# Altium schematic sheet Ref&Supply Unit.SchDoc
size A4; DocumentNumber: 5; SheetNumber: 5; SheetTotal: 7
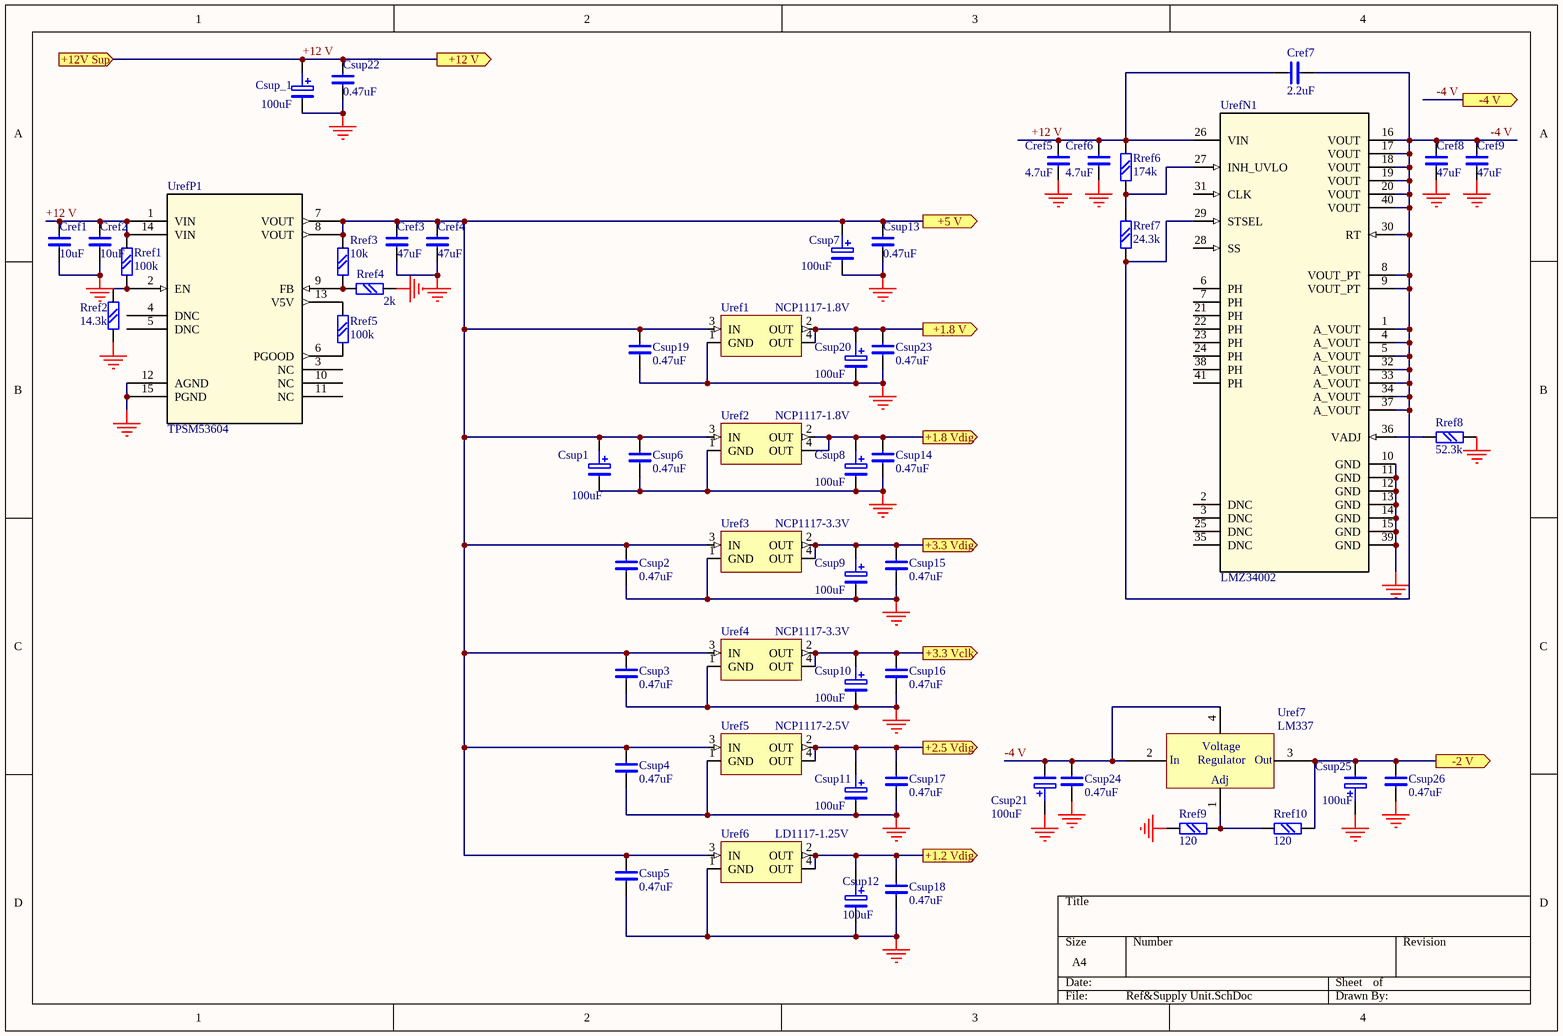
[diagram p0: Ref&Supply Unit.SchDoc]

## Parts
Cref1  10uF  [CHIP1206]
Cref2  10uF  [CHIP1206]
Cref3  47uF  [CHIP1206]
Cref4  47uF  [CHIP1206]
Cref5  4.7uF  [chip0805]
Cref6  4.7uF  [chip0805]
Cref7  2.2uF  [chip0805]
Cref8  47uF  [chip1206]
Cref9  47uF  [chip1206]
Csup1  100uF  [CEL-SMD300]
Csup2  0.47uF  [chip0603]
Csup3  0.47uF  [chip0603]
Csup4  0.47uF  [chip0603]
Csup5  0.47uF  [chip0603]
Csup6  0.47uF  [chip0603]
Csup7  100uF  [CEL-SMD300]
Csup8  100uF  [CEL-SMD300]
Csup9  100uF  [CEL-SMD300]
Csup10  100uF  [CEL-SMD300]
Csup11  100uF  [CEL-SMD300]
Csup12  100uF  [CEL-SMD300]
Csup13  0.47uF  [chip0603]
Csup14  0.47uF  [chip0603]
Csup15  0.47uF  [chip0603]
Csup16  0.47uF  [chip0603]
Csup17  0.47uF  [chip0603]
Csup18  0.47uF  [chip0603]
Csup19  0.47uF  [chip0603]
Csup20  100uF  [CEL-SMD300]
Csup21  100uF  [CEL-SMD300]
Csup22  0.47uF  [chip0603]
Csup23  0.47uF  [chip0603]
Csup24  0.47uF  [chip0603]
Csup25  100uF  [CEL-SMD300]
Csup26  0.47uF  [chip0603]
Csup_1  100uF  [CEL-SMD300]
Rref1  100k  [chip0603]
Rref2  14.3k  [chip0603]
Rref3  10k  [chip0603]
Rref4  2k  [chip0603]
Rref5  100k  [chip0603]
Rref6  174k  [chip0603]
Rref7  24.3k  [chip0603]
Rref8  52.3k  [chip0603]
Rref9  120  [chip0603]
Rref10  120  [chip0603]
Uref1  NCP1117-1.8V  [369A-13]
Uref2  NCP1117-1.8V  [369A-13]
Uref3  NCP1117-3.3V  [369A-13]
Uref4  NCP1117-3.3V  [369A-13]
Uref5  NCP1117-2.5V  [369A-13]
Uref6  LD1117-1.25V  [369A-13]
Uref7  LM337  [SOT-223]
UrefN1  LMZ34002  [B1QFN-41]
UrefP1  TPSM53604  [B3QFN-15]

## Ports
+1.2 Vdig (out), +1.8 V (out), +1.8 Vdig (out), +2.5 Vdig (out), +3.3 Vclk (out), +3.3 Vdig (out), +5 V (out), +12 V (out), +12V Sup (in), -2 V (out), -4 V (out)

## Nets
GND: Cref1.2 Cref2.2 Cref3.2 Cref4.2 Cref5.2 Cref6.2 Cref8.2 Cref9.2 Csup1.- Csup2.2 Csup3.2 Csup4.2 Csup5.2 Csup6.2 Csup7.- Csup8.- Csup9.- Csup10.- Csup11.- Csup12.- Csup13.2 Csup14.2 Csup15.2 Csup16.2 Csup17.2 Csup18.2 Csup19.2 Csup20.- Csup21.+ Csup22.2 Csup23.2 Csup24.2 Csup25.+ Csup26.2 Csup_1.- Rref2.1 Rref4.1 Rref8.2 Rref9.2 Uref1.1(GND) Uref2.1(GND) Uref3.1(GND) Uref4.1(GND) Uref5.1(GND) Uref6.1(GND) UrefN1.10(GND) UrefN1.11(GND) UrefN1.12(GND) UrefN1.13(GND) UrefN1.14(GND) UrefN1.15(GND) UrefN1.39(GND) UrefP1.12(AGND) UrefP1.15(PGND)
+1.2 Vdig: Csup12.+ Csup18.1 Uref6.2(OUT) Uref6.4(OUT) ; port +1.2 Vdig
+1.8 V: Csup20.+ Csup23.1 Uref1.2(OUT) Uref1.4(OUT) ; port +1.8 V
+1.8 Vdig: Csup8.+ Csup14.1 Uref2.2(OUT) Uref2.4(OUT) ; port +1.8 Vdig
+2.5 Vdig: Csup11.+ Csup17.1 Uref5.2(OUT) Uref5.4(OUT) ; port +2.5 Vdig
+3.3 Vclk: Csup10.+ Csup16.1 Uref4.2(OUT) Uref4.4(OUT) ; port +3.3 Vclk
+3.3 Vdig: Csup9.+ Csup15.1 Uref3.2(OUT) Uref3.4(OUT) ; port +3.3 Vdig
+5 V: Cref3.1 Cref4.1 Csup1.+ Csup2.1 Csup3.1 Csup4.1 Csup5.1 Csup6.1 Csup7.+ Csup13.1 Csup19.1 Rref3.2 Uref1.3(IN) Uref2.3(IN) Uref3.3(IN) Uref4.3(IN) Uref5.3(IN) Uref6.3(IN) UrefP1.7(VOUT) UrefP1.8(VOUT) ; port +5 V
+12 V: Cref1.1 Cref2.1 Cref5.1 Cref6.1 Cref7.1 Csup22.1 Csup_1.+ Rref1.2 Rref6.2 UrefN1.26(VIN) UrefP1.1(VIN) UrefP1.14(VIN) ; port +12V Sup, port +12 V
-2 V: Csup25.- Csup26.1 Rref10.1 Uref7.3(Out) ; port -2 V
-4 V: Cref7.2 Cref8.1 Cref9.1 Csup21.- Csup24.1 Rref7.1 Uref7.2(In) Uref7.4(Substrate) UrefN1.1(A_VOUT) UrefN1.4(A_VOUT) UrefN1.5(A_VOUT) UrefN1.8(VOUT_PT) UrefN1.9(VOUT_PT) UrefN1.16(VOUT) UrefN1.17(VOUT) UrefN1.18(VOUT) UrefN1.19(VOUT) UrefN1.20(VOUT) UrefN1.29(STSEL) UrefN1.30(RT) UrefN1.32(A_VOUT) UrefN1.33(A_VOUT) UrefN1.34(A_VOUT) UrefN1.37(A_VOUT) UrefN1.40(VOUT) ; port -4 V
NetRref1_1: Rref1.1 Rref2.2 UrefP1.2(EN)
NetRref3_1: Rref3.1 Rref4.2 UrefP1.9(FB)
NetRref5_1: Rref5.1 UrefP1.6(PGOOD)
NetRref5_2: Rref5.2 UrefP1.13(V5V)
NetRref6_1: Rref6.1 Rref7.2 UrefN1.27(INH_UVLO)
NetRref8_1: Rref8.1 UrefN1.36(VADJ)
NetRref9_1: Rref9.1 Rref10.2 Uref7.1(ADJ)

Not connected (* = marked no-connect by the designer): UrefN1 2(DNC) 3(DNC) 6(PH) 7(PH) 21(PH) 22(PH) 23(PH) 24(PH) 25(DNC) 28(SS) 31(CLK) 35(DNC) 38(PH) 41(PH); UrefP1 3(NC) 4(DNC) 5(DNC) 10(NC) 11(NC)

## Notes on the sheet
- (in symbol LM337) Voltage; Regulator; Adj

## Library data of the parts
Cref1-Cref9 Csup2-Csup6 Csup13-Csup19 Csup22-Csup24 Csup26 = C: Text Field1: 20; Text Field2: 10
Csup1 Csup7-Csup12 Csup20 Csup21 Csup25 Csup_1 = C POL: Text Field1: 20; Text Field2: 20
Rref1-Rref10 = MLT: Text Field1: 20; Text Field2: 20
Uref1 Uref2 Uref5 Uref6 = NCP1117-3.3V
Uref7 = LM337: Adjustable Negative Volage Regulators